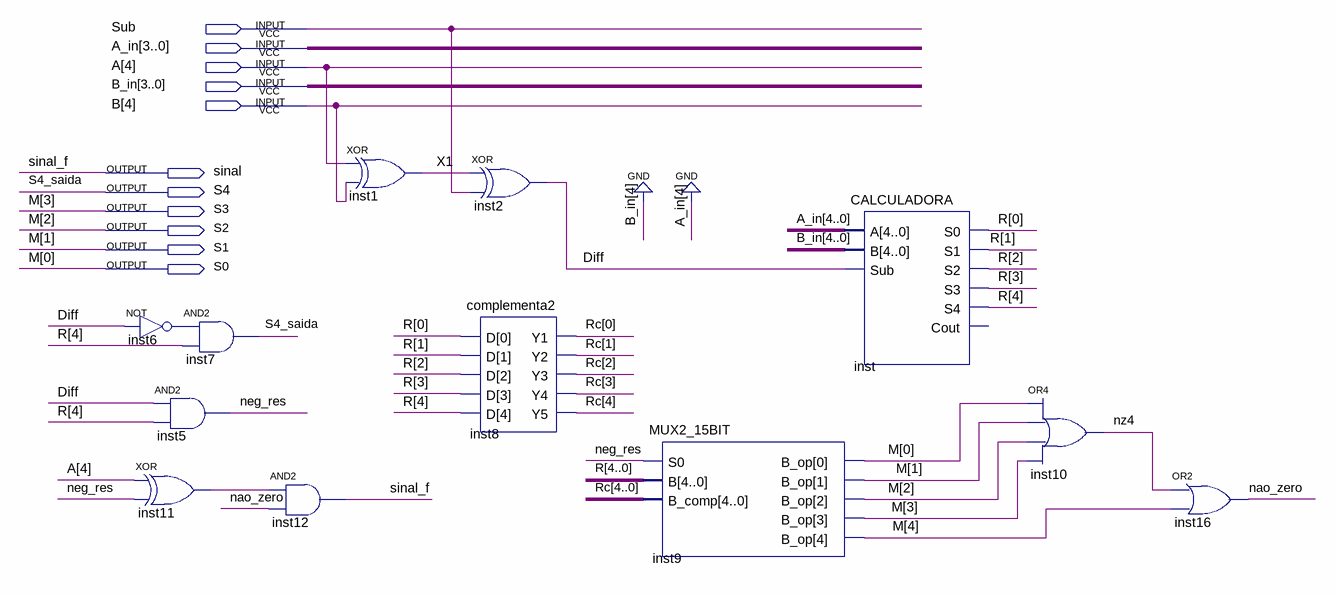
[diagram p0: schematic sheet]
// Quartus schematic CALCULATOR.bdf as structural Verilog: 12 symbols, 11 pins
module CALCULATOR (
  input  Sub,
  input  [3:0] A_in,
  input  [4:4] A,
  input  [3:0] B_in,
  input  [4:4] B,
  output sinal,
  output S4,
  output S3,
  output S2,
  output S1,
  output S0
);

  wire Diff, inst6_out, inst11_out, nao_zero, neg_res, nz4, X1;
  wire [4:0] R, Rc;
  wire [4:4] M;

  not inst6 (inst6_out, Diff);
  xor inst11 (inst11_out, A[4], neg_res);
  and inst7 (S4, inst6_out, R[4]);
  and inst5 (neg_res, Diff, R[4]);
  and inst12 (sinal, inst11_out, nao_zero);
  xor inst1 (X1, A[4], B[4]);
  xor inst2 (Diff, X1, Sub);
  complementa2 inst8 (.D(R), .Y1(Rc[0]), .Y2(Rc[1]), .Y3(Rc[2]), .Y4(Rc[3]), .Y5(Rc[4]));
  MUX2_15BIT inst9 (.S0(neg_res), .B(R), .B_comp(Rc), .B_op({M[4], S3, S2, S1, S0}));
  CALCULADORA inst (
    .A({1'b0, A_in}), .B({1'b0, B_in}), .Sub(Diff), .S0(R[0]), .S1(R[1]), .S2(R[2]), .S3(R[3]), .S4(R[4]));  // open: Cout
  or inst10 (nz4, S0, S1, S2, S3);
  or inst16 (nao_zero, nz4, M[4]);

  // Other names for the same wires on the sheet: M[3:0] = {S3, S2, S1, S0}; S4_saida = S4; sinal_f = sinal
endmodule
